# Altium schematic sheet Neon-Demon-Earing-revC.SchDoc
size A4; SheetNumber: 1; SheetTotal: 1
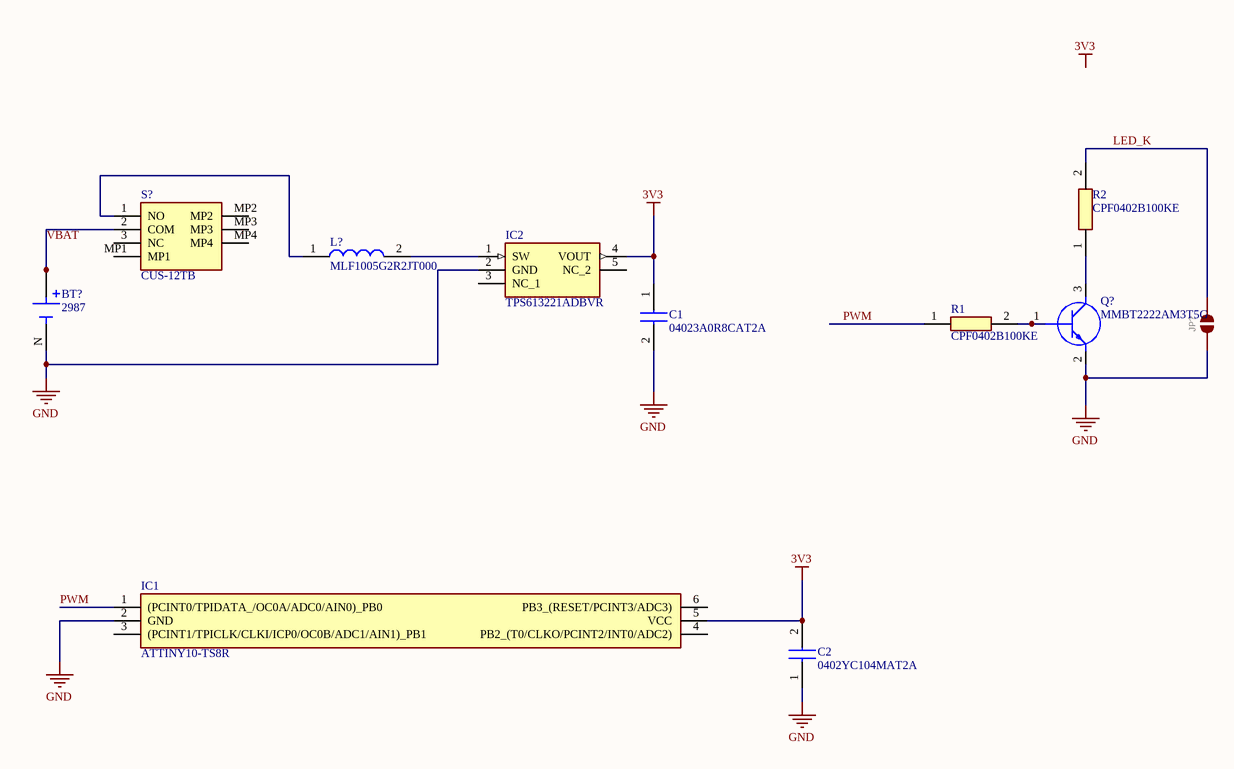
[diagram p0: Neon-Demon-Earing-revC.SchDoc]

## Parts
BT?  2987  [BAT_2987]
C1  04023A0R8CAT2A  [CAPC1005X56N]
C2  0402YC104MAT2A  [CAPC1005X56N]
IC1  ATTINY10-TS8R  [SOT95P280X145-6N]
IC2  TPS613221ADBVR  [SOT95P280X145-5N]
JP?  Normally open jumper    This jumper has two pads in close proximity to each other. Apply solder to close the connection.   Round pads are easier to solder for beginners, but are a lot larger.   SparkFun Product that uses the round pads:  SparkFun EL Sequencer  [SMT-JUMPER_2_NO_SILK]  (value not drawn)
L?  MLF1005G2R2JT000  [INDC1005X55N]
Q?  MMBT2222AM3T5G  [SOTFL40P120X55-3N]
R1  CPF0402B100KE  [RESC1005X35N]
R2  CPF0402B100KE  [RESC1005X35N]
S?  CUS-12TB  [CUS12TB]

## Nets
3V3: C1.1 C2.2 IC1.5(VCC) IC2.4(VOUT)
GND: BT?.N(NEG) C1.2 C2.1 IC1.2(GND) IC2.2(GND) JP?.1 Q?.2(E)
LED_K: JP?.2 R2.2
PWM: IC1.1((PCINT0/TPIDATA_/OC0A/ADC0/AIN0)_PB0) R1.1
VBAT: BT?.P1(POS) BT?.P2(POS) S?.2(COM)
NetIC2_1: IC2.1(SW) L?.2
NetL?_1: L?.1 S?.1(NO)
NetQ?_1: Q?.1(B) R1.2
NetQ?_3: Q?.3(C) R2.1

Not connected (* = marked no-connect by the designer): IC1 3((PCINT1/TPICLK/CLKI/ICP0/OC0B/ADC1/AIN1)_PB1) 4(PB2_(T0/CLKO/PCINT2/INT0/ADC2)) 6(PB3_(RESET/PCINT3/ADC3)); IC2 3(NC_1) 5(NC_2); S? 3(NC) MP1 MP2 MP3 MP4

## Notes on the sheet
- Labels drawn without touching a wire or pin: 3V3

## Library data of the parts
C1 = 04023A0R8CAT2A: Capacitor; Manufacturer_Name: AVX; Datasheet Link: http://www.mouser.com/catalog/supplier/library/pdf/AVXSurfaceMountCeramic.pdf; Height: 0.56mm; Manufacturer_Part_Number: 04023A0R8CAT2A; Mouser Part Number: 581-04023A0R8CAT2A; Mouser Price/Stock: https://www.mouser.co.uk/ProductDetail/AVX/04023A0R8CAT2A?qs=ZwvTZoB9SO%252BVBOZ%252BNMbjzw%3D%3D
C2 = 0402YC104MAT2A: Capacitor; Manufacturer_Name: AVX; Datasheet Link: http://www.mouser.com/catalog/supplier/library/pdf/AVXSurfaceMountCeramic.pdf; Height: 0.56mm; Manufacturer_Part_Number: 0402YC104MAT2A; Mouser Part Number: 581-0402YC104MAT2A; Mouser Price/Stock: https://www.mouser.co.uk/ProductDetail/AVX/0402YC104MAT2A?qs=O2%2FeDh0sX9yiCaLwpXy1bw%3D%3D
IC1 = ATTINY10-TS8R: Integrated Circuit; Manufacturer_Name: Microchip; Datasheet Link: http://www.microchip.com/mymicrochip/filehandler.aspx?ddocname=en589725; Height: 1.45mm; Manufacturer_Part_Number: ATTINY10-TS8R; Mouser Part Number: 556-ATTINY10-TS8R; Mouser Price/Stock: https://www.mouser.co.uk/ProductDetail/Microchip-Technology/ATTINY10-TS8R?qs=lwdSMh1%2FoYJoa4IfQuMJgQ%3D%3D; Arrow Part Number: ATTINY10-TS8R; Arrow Price/Stock: https://www.arrow.com/en/products/attiny10-ts8r/microchip-technology?region=nac
IC2 = TPS613221ADBVR: Power Supply; Manufacturer_Name: Texas Instruments; Datasheet Link: http://www.ti.com/lit/gpn/tps61322; Height: 1.45mm; Manufacturer_Part_Number: TPS613221ADBVR; Mouser Part Number: 595-TPS613221ADBVR; Mouser Price/Stock: https://www.mouser.co.uk/ProductDetail/Texas-Instruments/TPS613221ADBVR?qs=W0yvOO0ixfEzYGaKZaJgrw%3D%3D; Arrow Part Number: TPS613221ADBVR; Arrow Price/Stock: https://www.arrow.com/en/products/tps613221adbvr/texas-instruments?region=nac
JP? = JUMPER-SMT_2_NO_SILK: GateName_1: G$1; SymbolName_1: SMT-JUMPER_2_NO; DeviceName: _SILK; LibraryName: SparkFun-Jumpers; DeviceSetName: JUMPER-SMT_2_NO; Package: SMT-JUMPER_2_NO_SILK
L? = MLF1005G2R2JT000: Inductor; Manufacturer_Name: TDK-Lambda; Datasheet Link: https://product.tdk.com/system/files/dam/doc/product/inductor/inductor/smd/catalog/inductor_commercial_standard_mlf1005_en.pdf; Height: 0.55mm; Manufacturer_Part_Number: MLF1005G2R2JT000; Mouser Part Number: 810-MLF1005G2R2JT000; Mouser Price/Stock: https://www.mouser.co.uk/ProductDetail/TDK/MLF1005G2R2JT000?qs=%2FPzWLGNeQ%252BhXmsvIBrs2gg%3D%3D
Q? = MMBT2222AM3T5G: Transistor BJT NPN; Manufacturer_Name: onsemi; Datasheet Link: http://www.onsemi.com/pub/Collateral/MMBT2222AM3-D.PDF; Height: 0.55mm; Manufacturer_Part_Number: MMBT2222AM3T5G; Mouser Part Number: 863-MMBT2222AM3T5G; Mouser Price/Stock: https://www.mouser.co.uk/ProductDetail/onsemi/MMBT2222AM3T5G?qs=N5dOQkml4H%252BwlTOlL9%2F4UA%3D%3D; Arrow Part Number: MMBT2222AM3T5G; Arrow Price/Stock: https://www.arrow.com/en/products/mmbt2222am3t5g/on-semiconductor?region=nac
R1 R2 = CPF0402B100KE: Resistor; Manufacturer_Name: TE Connectivity; Datasheet Link: http://www.farnell.com/datasheets/1786775.pdf; Height: 0.35mm; Manufacturer_Part_Number: CPF0402B100KE; Mouser Part Number: 279-CPF0402B100KE; Mouser Price/Stock: https://www.mouser.co.uk/ProductDetail/TE-Connectivity-Holsworthy/CPF0402B100KE?qs=CXI0wBT1M2h4W2Gm72yIGA%3D%3D; Arrow Part Number: CPF0402B100KE; Arrow Price/Stock: https://www.arrow.com/en/products/cpf0402b100ke/te-connectivity?region=nac
S? = CUS-12TB: Switch; Manufacturer_Name: Nidec Copal; Datasheet Link: https://www.nidec-copal-electronics.com/e/catalog/switch/cus.pdf; Height: 1.4mm; Manufacturer_Part_Number: CUS-12TB; Mouser Part Number: 229-CUS-12TB; Mouser Price/Stock: https://www.mouser.co.uk/ProductDetail/Nidec-Components/CUS-12TB?qs=XeJtXLiO41Q1Ug1dC3Bq%2FQ%3D%3D
BT? = 2987: Package: None; Price: None; Value: *; MP: 2987; Availability: Unavailable